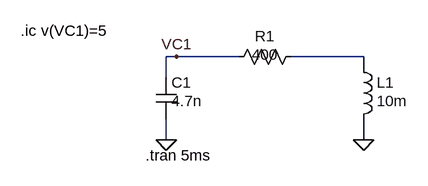
[diagram p0: schematic meca-RLC-Ech1.asc]
meca-RLC-Ech1.asc, the LTspice schematic file:
Version 4
SHEET 1 880 680
WIRE 48 128 32 128
WIRE 144 128 48 128
WIRE 336 128 224 128
WIRE 336 144 336 128
WIRE 32 160 32 128
WIRE 32 256 32 224
WIRE 336 256 336 224
FLAG 336 256 0
FLAG 32 256 0
FLAG 48 128 VC1
SYMBOL res 128 144 R270
WINDOW 0 32 56 VTop 2
WINDOW 3 4 56 VTop 2
SYMATTR InstName R1
SYMATTR Value 400
SYMBOL ind 320 128 R0
WINDOW 3 36 68 Left 2
SYMATTR InstName L1
SYMATTR Value 10m
SYMBOL cap 16 160 R0
WINDOW 3 24 36 Left 2
SYMATTR InstName C1
SYMATTR Value 4.7n
TEXT 0 280 Left 2 !.tran 5ms
TEXT -192 88 Left 2 !.ic v(VC1)=5

The netlist it stands for:
* meca-RLC-Ech1.asc
R1 VC1 N001 400
L1 N001 0 10m
C1 VC1 0 4.7n
.tran 5ms
.ic v(VC1)=5
.backanno
.end